# EasyEDA Pro project ProProject_drv8303_f405rgt6_3_5_2025-03-30.epro, schematic Schematic1
Create Date: 2025-03-05; Page Name: P1; Project Name: drv8303_f405rgt6_3_5; Schematic Name: Schematic1; Update Date: 2025-03-10; Company: 嘉立创EDA; Page Size: A4; Version: V1.0
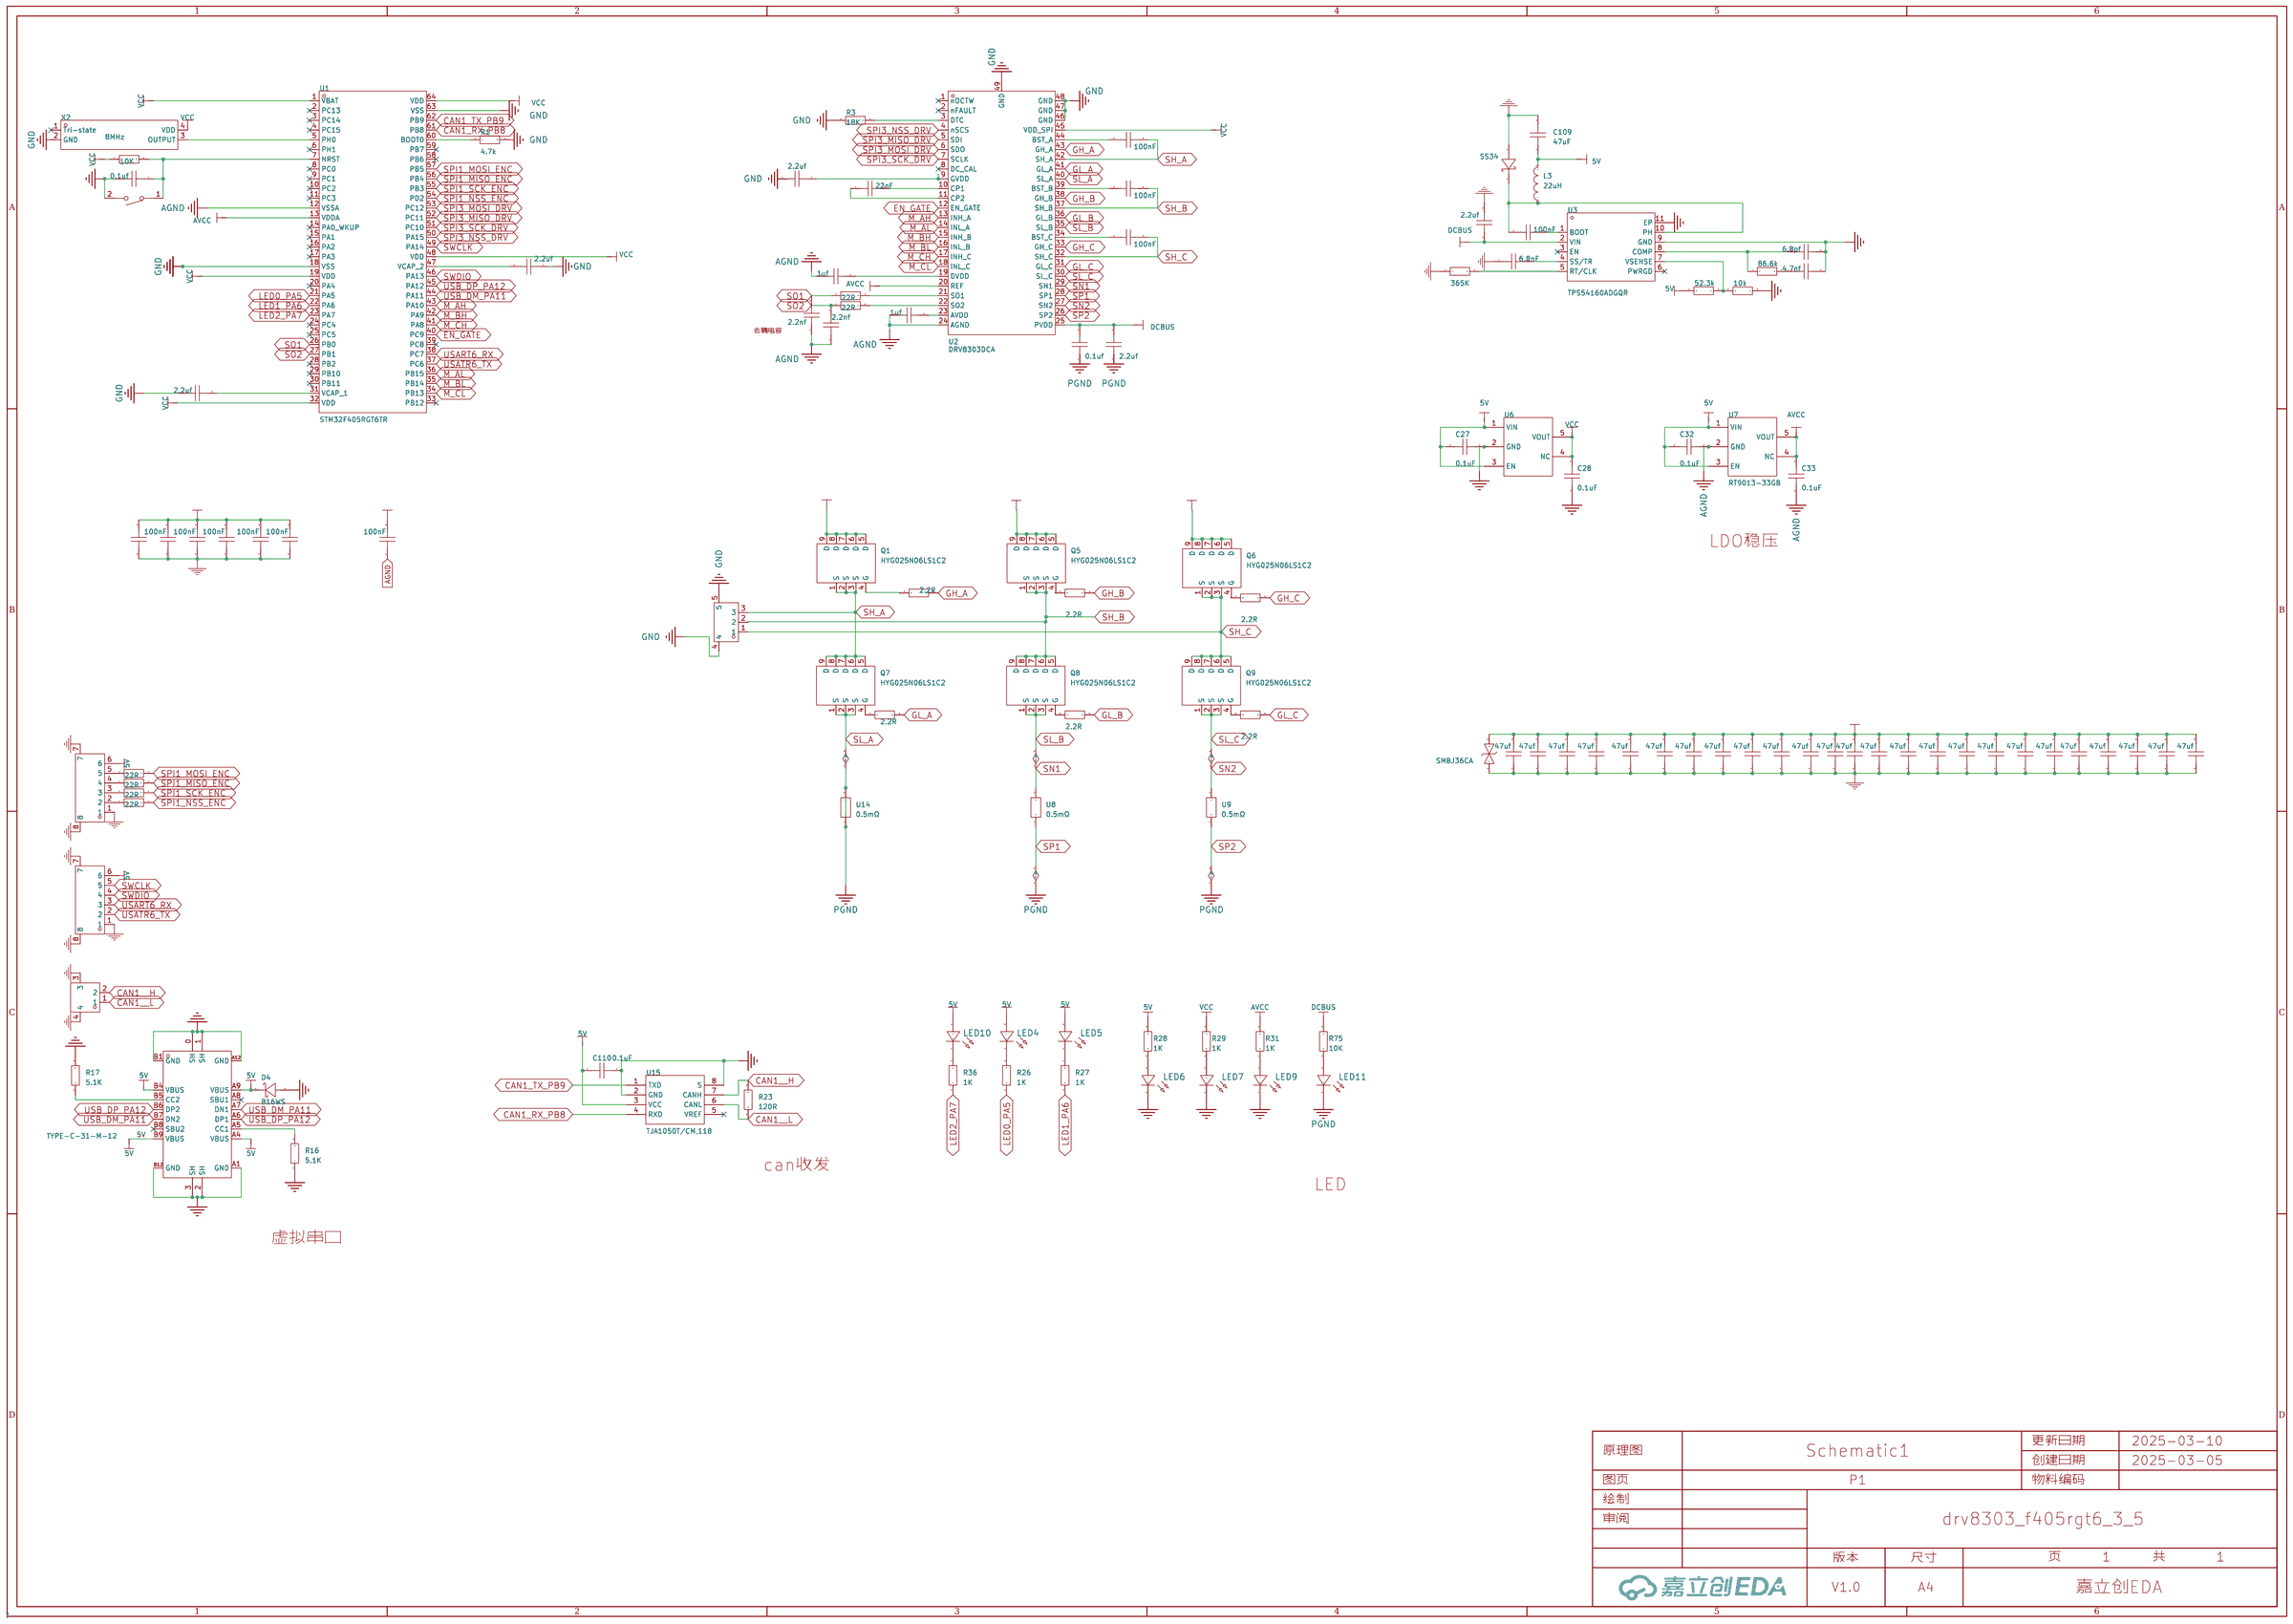
[diagram p0: schematic sheet]

## Parts
C1  2.2uf  [C0603]
C2  2.2uf  [C0603]
C3  0.1uf  [C0603]
C4  22nF  [C0603]
C7  0.1uf  [C0603]
C8  2.2uf  [C0603]
C9  1uf  [C0603]
C10  2.2uf  [C0603]
C11  1uf  [C0603]
C12  100nF  [C0603]
C13  100nF  [C0603]
C14  100nF  [C0603]
C15  2.2nf  [C0603]
C16  2.2nf  [C0603]
C17  100nF  [C0603]
C18  2.2uf  [C0603]
C19  6.8nF  [C0603]
C20  6.8pf  [C0603]
C21  4.7nf  [C0603]
C27  0.1uF  [C0603]
C28  0.1uF  [C0603]
C32  0.1uF  [C0603]
C33  0.1uF  [C0603]
C85  100nF  [C0603]
C86  100nF  [C0603]
C87  100nF  [C0603]
C88  100nF  [C0603]
C89  100nF  [C0603]
C90  100nF  [C0603]
C91  100nF  [C0603]
C97  47uf  [C0603]
C98  47uf  [C0603]
C99  47uf  [C0603]
C100  47uf  [C0603]
C101  47uf  [C0603]
C102  47uf  [C0603]
C103  47uf  [C0603]
C104  47uf  [C0603]
C105  47uf  [C0603]
C106  47uf  [C0603]
C107  47uf  [C0603]
C108  47uf  [C0603]
C109  47uF  [C1206]
C110  0.1uF  [C0603]
C111  47uf  [C0603]
C112  47uf  [C0603]
C113  47uf  [C0603]
C114  47uf  [C0603]
C115  47uf  [C0603]
C116  47uf  [C0603]
C117  47uf  [C0603]
C118  47uf  [C0603]
C120  47uf  [C0603]
C121  47uf  [C0603]
C122  47uf  [C0603]
C123  47uf  [C0603]
C124  47uf  [C0603]
CN2  WAFER-GH1.25-2PLB  [CONN-TH_2P-P1.25_XUNPU_WAFER-GH1.25-2PLB]
D4  B16WS  [SOD-323_L1.7-W1.3-LS2.5-FD]
D5  SS34  [SMA_L4.3-W2.6-LS5.0-FD]
D6  SMBJ36CA  [SMB_L4.6-W3.6-LS5.4-BI]
L3  22uH  [IND-SMD_L2.5-W2.0]
LED4  -  [LED_0603]
LED5  -  [LED_0603]
LED6  -  [LED_0603]
LED7  -  [LED_0603]
LED9  -  [LED_0603]
LED10  -  [LED_0603]
LED11  -  [LED_0603]
Q1  HYG025N06LS1C2  [DFN-8_L5.9-W5.2-P1.27-LS6.2-BL]
Q5  HYG025N06LS1C2  [DFN-8_L5.9-W5.2-P1.27-LS6.2-BL]
Q6  HYG025N06LS1C2  [DFN-8_L5.9-W5.2-P1.27-LS6.2-BL]
Q7  HYG025N06LS1C2  [DFN-8_L5.9-W5.2-P1.27-LS6.2-BL]
Q8  HYG025N06LS1C2  [DFN-8_L5.9-W5.2-P1.27-LS6.2-BL]
Q9  HYG025N06LS1C2  [DFN-8_L5.9-W5.2-P1.27-LS6.2-BL]
R1  4.7k  [R0603]
R2  10K  [R0603]
R3  18K  [R0603]
R4  22R  [R0603]
R5  22R  [R0603]
R16  5.1K  [R0603]
R17  5.1K  [R0603]
R23  120R  [R0603]
R26  1K  [R0603]
R27  1K  [R0603]
R28  1K  [R0603]
R29  1K  [R0603]
R31  1K  [R0603]
R36  1K  [R0603]
R55  86.6k  [R0603]
R56  52.3k  [R0603]
R57  10k  [R0603]
R64  365K  [R0603]
R65  2.2R  [R0603]
R66  2.2R  [R0603]
R67  2.2R  [R0603]
R68  2.2R  [R0603]
R69  2.2R  [R0603]
R70  2.2R  [R0603]
R71  22R  [R0603]
R72  22R  [R0603]
R73  22R  [R0603]
R74  22R  [R0603]
R75  10K  [R0603]
SW9  TS-1088-AR02016  [SW-SMD_L3.9-W3.0-P4.45]
U1  STM32F405RGT6TR  [LQFP-64_L10.0-W10.0-P0.50-LS12.0-BL]
U2  DRV8303DCA  [HTSSOP-48_L12.5-W6.1-P0.50-LS8.1-BL-EP4.4]
U3  TPS54160ADGQR  [MSOP-10_L3.0-W3.0-P0.50-LS5.0-BL-EP]
U6  RT9013-33GB  [SOT-23-5_L3.0-W1.7-P0.95-LS2.8-BL]
U7  RT9013-33GB  [SOT-23-5_L3.0-W1.7-P0.95-LS2.8-BL]
U8  0.5mΩ  [RES-SMD_L6.4-W3.2-R2512]
U9  0.5mΩ  [RES-SMD_L6.4-W3.2-R2512]
U11  WAFER-GH1.25-6PLB  [CONN-SMD_6P-P1.25_XUNPU_WAFER-GH1.25-6PLB]
U12  WAFER-GH1.25-6PLB  [CONN-SMD_6P-P1.25_XUNPU_WAFER-GH1.25-6PLB]
U13  MR30PW-M30.G.Y  [CONN-TH_MR30PW-M30-G-Y]
U14  0.5mΩ  [RES-SMD_L6.4-W3.2-R2512]
U15  TJA1050T/CM,118  [SOIC-8_L5.0-W4.0-P1.27-LS6.0-BL]
USBC1  TYPE-C-31-M-12  [USB-C_SMD-TYPE-C-31-M-12]
X2  8MHz  [OSC-SMD_4P-L3.2-W2.5-BL]

## Library data of the parts
C1-C4 C7-C21 C27 C28 C32 C33 C85-C91 C97-C108 C110-C118 C120-C124 = CAP_0603: Supplier Footprint: 0603
C109 = HGC1206R5476M250NSPJ: 容值:47uF;精度:±20%;额定电压:25V;材质(温度系数):X5R;; LCSC Part Name: 47uF ±20% 25V; Supplier Part: C22367835; Manufacturer: Chinocera(华瓷); Supplier Footprint: 1206; JLCPCB Part Class: 扩展库; Datasheet: https://atta.szlcsc.com/upload/public/pdf/source/20240326/E6CB0DC43BB858B74F4352229FABFDCA.pdf; Supplier: LCSC; Tolerance: ±20%; Voltage Rated: 25V; Temperature Coefficient: X5R
CN2 = WAFER-GH1.25-2PLB: 插针结构:1x2P;间距:1.25mm;安装方式:立贴;参考系列:GH;总PIN数:2P;排数:1;每排PIN数:2;行距:-;额定电流:1A;触头材质:黄铜;触头镀层:-;工作温度范围:-25℃~+85℃;; LCSC Part Name: 1x2P 间距:1.25mm 立贴 系列:GH; Supplier Part: C3029368; Manufacturer: XUNPU(讯普); Supplier Footprint: SMD,P=1.25mm; JLCPCB Part Class: 扩展库; Datasheet: https://atta.szlcsc.com/upload/public/pdf/source/20220527/44F824AAC8C2B617205E15955FF9C23D.pdf; Supplier: LCSC; Pins Structure: 1x2P; Pitch: 1.25mm; Mounting Type: 立贴; Reference Series: GH; Number of Pins: 2P; Number of Rows: 1; Number of PINs Per Row: 2; Current Rating: 1A; Contact Material: 黄铜; Operating Temperature: -25℃~+85℃; Voltage Rating: 125V; Plastic Material: LCP; Supplementary Features: 辅助焊脚; Color: 米色; Z-Height of the Board: 4.2mm; X-Length of Bottom Edge on Board (Spacing Line): 5.75mm; Y-Width of Bottom Edge on Board: 4.95mm
D4 = B16WS_C7420327: 二极管配置:独立式;正向压降(Vf):700mV@1A;直流反向耐压(Vr):60V;平均整流电流(Io):1A;; LCSC Part Name: 电压:60V 电流:1A; Supplier Part: C7420327; Manufacturer: 宏迦橙; Supplier Footprint: SOD-323; JLCPCB Part Class: 扩展库; Datasheet: https://atta.szlcsc.com/upload/public/pdf/source/20230828/F9ABA74578AB4CF1325004D8C613CE3A.pdf; Supplier: LCSC; Diode Configuration: 独立式; Forward Voltage (Vf@If): 700mV@1A; Reverse Voltage (Vr): 60V; Average Rectified Current (Io): 1A; Reverse Leakage Current (Ir): 100uA@60V; Peak forward surge current: 10A
D5 = SS34_C7420365: 二极管配置:独立式;正向压降(Vf):550mV@3.0A;直流反向耐压(Vr):40V;平均整流电流(Io):3A;; LCSC Part Name: 电压:40V 电流:3A; Supplier Part: C7420365; Manufacturer: 宏迦橙; Supplier Footprint: SMA(DO-214AC); JLCPCB Part Class: 扩展库; Datasheet: https://atta.szlcsc.com/upload/public/pdf/source/20230828/75438452AEE6C276EDA92B2AF599BE05.pdf; Supplier: LCSC; Diode Configuration: 独立式; Forward Voltage (Vf@If): 550mV@3.0A; Reverse Voltage (Vr): 40V; Average Rectified Current (Io): 3A; Reverse Leakage Current (Ir): 200uA@40V; Peak forward surge current: 80A
D6 = SMBJ36CA_C2891335: 反向截止电压(Vrwm):36V;钳位电压:58.1V;峰值脉冲电流(Ipp):10.3A;峰值脉冲功率(Ppp):600W;击穿电压:40V;; LCSC Part Name: 双向TVS 36V截止 10.3A峰值脉冲; Supplier Part: C2891335; Manufacturer: GOODWORK(固得沃克); Supplier Footprint: SMB(DO-214AA); JLCPCB Part Class: 扩展库; Datasheet: https://atta.szlcsc.com/upload/public/pdf/source/20240508/1CA20C3E2CA17788E1A78E427E8A26EF.pdf; Supplier: LCSC; Reverse Stand-Off Voltage (Vrwm): 36V; Clamping Voltage: 58.1V; Peak Pulse Current (Ipp): 10.3A; Peak Pulse Power Dissipation (Ppp): 600W; Voltage - Breakdown: 40V; Reverse Leakage Current (Ir): 5uA; Operating Temperature: -55℃~+150℃@(Tj); Type: TVS
L3 = FNR252012S2R2MT: 电感值:2.2uH;精度:±20%;额定电流:1.25A;饱和电流(Isat):2.07A;; LCSC Part Name: 2.2uH ±20% 2.07A; Supplier Part: C167693; Manufacturer: cjiang(长江微电); Supplier Footprint: 1008; JLCPCB Part Class: 扩展库; Datasheet: https://atta.szlcsc.com/upload/public/pdf/source/20190327/C167925_9EFF0AABC4CA629C2CC95961DBF7D39D.pdf; Supplier: LCSC; Tolerance: ±20%; Rated Current: 1.25A; Saturation Current (Isat): 2.07A; DC Resistance (DCR): 216mΩ
LED4-LED7 LED9-LED11 = LED_0603-R: Supplier Footprint: 0603
Q1 Q5-Q9 = HYG025N06LS1C2: 类型:1个N沟道;漏源电压(Vdss):60V;连续漏极电流(Id):170A;导通电阻(RDS(on)):2.1mΩ@10V;耗散功率(Pd):130W;阈值电压(Vgs(th)):2.1V;; LCSC Part Name: 单N沟道MOSFET,电流:170A,耐压:60V; Supplier Part: C2827231; Manufacturer: HUAYI(华羿微); Supplier Footprint: DFN-8(5.2x5.9); JLCPCB Part Class: 扩展库; Datasheet: https://atta.szlcsc.com/upload/public/pdf/source/20210419/C2827231_13841C0339ED96AF58AC5A6C3EF7CB2D.pdf; Supplier: LCSC; Type: 1个N沟道; Drain to Source Voltage: 60V; Current - Continuous Drain(Id): 170A; RDS(on): 2.1mΩ@10V; Pd - Power Dissipation: 130W; Gate Threshold Voltage (Vgs(th)@Id): 2.1V; Gate Charge(Qg): 59.5nC@10V; Input Capacitance(Ciss@Vds): 3.915nF@0V; Reverse Transfer Capacitance (Crss@Vds): 10.2pF; Operating Temperature: -55℃~+175℃
R1-R5 R16 R17 R23 R26-R29 R31 R36 R55-R57 R64-R75 = Res_0603: Supplier Footprint: 0603
SW9 = TS-1088-AR02016: 触点电流:50mA;额定电压(DC):12V;绝缘电阻:100MΩ;电路结构:单刀单掷;安装方式:立贴;作用力:160gf@±50gf;机械寿命:10万次;带支架:否;; LCSC Part Name: 4*3*2mm 立贴 轻触开关; Supplier Part: C720477; Manufacturer: XUNPU(讯普); Supplier Footprint: SMD; JLCPCB Part Class: 扩展库; Datasheet: https://atta.szlcsc.com/upload/public/pdf/source/20200810/C720475_60D09DD6C54279ADDB2DC25100F1CC11.pdf; Supplier: LCSC; Contact Current: 50mA; Voltage Rating (DC): 12V; Insulation Resistance: 100MΩ; Circuit: 单刀单掷; Mounting Style: 立贴; Actuator Style: 圆形按钮; Actuator/Cap Color: 黑色; Operating Force: 160gf@±50gf; Mechanical Life: 10万次; Operating Temperature: -30℃~+80℃; Pin Style: SMD接片; Switch Length: 4mm; Switch Width: 3mm; Switch Height: 2mm; Strike Gundam: 否
U1 = STM32F405RGT6TR: CPU内核:ARM-M4;CPU最大主频:168MHz;应用领域:-;; LCSC Part Name: 带DSP和FPU的高性能基础系列ARM Cortex-M4 MCU，具有1 MB Flash、168 MHz CPU和ART加速器; Supplier Part: C2054141; Manufacturer: ST(意法半导体); Supplier Footprint: LQFP-64(10x10); JLCPCB Part Class: 扩展库; Datasheet: https://atta.szlcsc.com/upload/public/pdf/source/20201130/C919362_39400D478C258148B3DF984CE4A4041A.pdf; Supplier: LCSC; CPU Core: ARM-M4; CPU Maximum Speed: 168MHz; Program Storage Size: 1MB; Program Memory Type: FLASH; Number of I/O: 51; ADC (Bit): 12bit; DAC (Bit): 12bit; Low Voltage Detection Threshold: 1.8V~3.6V
U2 = DRV8303DCA: DRV8303 具有电流分流放大器和 SPI 的最大 65V 三相栅极驱动器; LCSC Part Name: 无刷直流BLDC电机驱动芯片 60V; Supplier Part: C1523892; Manufacturer: TI(德州仪器); Supplier Footprint: HTSSOP-48-EP-6.1mm; JLCPCB Part Class: 扩展库; Datasheet: https://www.ti.com/cn/lit/gpn/drv8303; Supplier: LCSC
U3 = TPS54160ADGQR: 功能类型:降压型;输出类型:固定;工作电压:3.5V~60V;输出电压:800mV~58V;输出电流:1.5A;; LCSC Part Name: 60V 1.5A降压DC/DC转换器; Supplier Part: C390949; Manufacturer: TI(德州仪器); Supplier Footprint: MSOP-10-EP; JLCPCB Part Class: 扩展库; Datasheet: https://www.ti.com/cn/lit/gpn/tps54160a; Supplier: LCSC; Function: 降压型; Output Type: 固定; Input Voltage: 3.5V~60V; Output Voltage: 800mV~58V; Output Current: 1.5A; Switching Frequency: 100kHz~2.5MHz; Operating Temperature: -40℃~+150℃; Synchronous Rectification: 是; Number of Outputs: 1; Topology: 降压式; Quiescent Current (Iq): 116uA; Switch tube (built-in/external): 内置
U6 U7 = RT9013-33GB: 输出类型:固定;输出极性:正;最大输入电压:5.5V;输出电压:3.3V;输出电流:500mA;电源纹波抑制比(PSRR):50dB@(10kHz);; Supplier Part: C47773; Manufacturer: RICHTEK(立锜); Supplier Footprint: SOT-23-5; JLCPCB Part Class: Extended Part; Datasheet: https://atta.szlcsc.com/upload/public/pdf/source/20150504/1457707282459.pdf; Supplier: LCSC; Output Type: 固定; Output Polarity: 正; Number of Outputs: 1; Maximum Input Voltage: 5.5V; Output Voltage: 3.3V; Dropout Voltage: 400mV@(500mA); Output Current: 500mA; Power Supply Rejection Ratio (PSRR): 50dB@(10kHz)
U8 U9 U14 = LRAN25GJER0005S: 电阻类型:采样电阻;阻值:0.5mΩ;精度:±5%;功率:3W;; LCSC Part Name: 0.5mΩ ±5% 3W; Supplier Part: C5121029; Manufacturer: NCT(利昇达); Supplier Footprint: 2512; JLCPCB Part Class: 扩展库; Datasheet: https://atta.szlcsc.com/upload/public/pdf/source/20220802/2693C2EE618FE3489E564C832611E315.pdf; Supplier: LCSC; Type: 采样电阻; Tolerance: ±5%; Power(Watts): 3W
U11 U12 = WAFER-GH1.25-6PLB: 插针结构:1x6P;间距:1.25mm;安装方式:立贴;参考系列:GH;总PIN数:6P;排数:1;每排PIN数:6;行距:-;额定电流:1A;触头材质:黄铜;触头镀层:-;工作温度范围:-25℃~+85℃;; LCSC Part Name: 1x6P 间距:1.25mm 立贴 系列:GH; Supplier Part: C3029372; Manufacturer: XUNPU(讯普); Supplier Footprint: SMD,P=1.25mm; JLCPCB Part Class: 扩展库; Datasheet: https://atta.szlcsc.com/upload/public/pdf/source/20220527/44F824AAC8C2B617205E15955FF9C23D.pdf; Supplier: LCSC; Pins Structure: 1x6P; Pitch: 1.25mm; Mounting Type: 立贴; Reference Series: GH; Number of Pins: 6P; Number of Rows: 1; Number of PINs Per Row: 6; Current Rating: 1A; Contact Material: 黄铜; Operating Temperature: -25℃~+85℃; Voltage Rating: 125V; Plastic Material: LCP; Supplementary Features: 辅助焊脚; Color: 米色; Z-Height of the Board: 4.2mm; X-Length of Bottom Edge on Board (Spacing Line): 10.75mm; Y-Width of Bottom Edge on Board: 4.95mm
U13 = MR30PW-M30.G.Y: LCSC Part Name: MR30PW20三芯PCB 弯插公金黄H=3mm; Supplier Part: C19268036; Manufacturer: AMASS(艾迈斯); JLCPCB Part Class: 扩展库; Datasheet: https://atta.szlcsc.com/upload/public/pdf/source/20231221/E63D24EDC016665263C6304FABBAAC61.pdf; Supplier: LCSC
U15 = TJA1050T/CM,118: 类型:收发器;; LCSC Part Name: 4.75V~5.25V; Supplier Part: C6952; Manufacturer: NXP(恩智浦); Supplier Footprint: SOIC-8; JLCPCB Part Class: Basic Part; Datasheet: https://atta.szlcsc.com/upload/public/pdf/source/20140411/1457707042917.pdf; Supplier: LCSC; Type: 收发器; Supply Voltage: 4.75V~5.25V; Supply Current: 50mA
USBC1 = TYPE-C-31-M-12: 连接器类型:Type-C;标准:-;公母:母座;触点数量:16;端口数量:1;安装方式:-;额定电流 - 电源:5A;触头材质:-;触头镀层:-;工作温度范围:-;焊接温度(最大值):-;; LCSC Part Name: Type-C 母座; Supplier Part: C165948; Manufacturer: 韩国韩荣; Supplier Footprint: SMD; JLCPCB Part Class: Extended Part; Datasheet: https://atta.szlcsc.com/upload/public/pdf/source/20220525/466408E853115E789EDB0DDC29077C05.pdf; Supplier: LCSC; Connector Type: Type-C; Gender: 母座; Number of Contacts: 16; Number of Ports: 1; Current Rating - Power (Max): 5A
X2 = OT32258MJBA4SL: 频率:8MHz;频率稳定度:±10ppm;工作电压:1.8V~3.3V;; LCSC Part Name: 8MHz ±10ppm 1.8V~3.3V; Supplier Part: C717687; Manufacturer: YXC(扬兴晶振); Supplier Footprint: SMD3225-4P; JLCPCB Part Class: Extended Part; Datasheet: https://atta.szlcsc.com/upload/public/pdf/source/20210329/C669065_30B18CFE780D377BA4E84F6ED1951959.pdf; Supplier: LCSC; Frequency Stability: ±10ppm; Supply Voltage: 1.8V~3.3V; Operating Temperature: -40℃~+85℃

## Nets
5V: C27.2 C32.2 C109.1 C110.1 D4.2(K) L3.2 LED4.2(A) LED5.2(A) LED10.2(A) R28.2 R56.1 U6.1(VIN) U6.3(EN) U7.1(VIN) U7.3(EN) U11.6 U12.6 U15.3(VCC) USBC1.A4(VBUS) USBC1.A9(VBUS) USBC1.B4(VBUS) USBC1.B9(VBUS)
AGND: C9.2 C11.2 C15.1 C16.1 C32.1 C33.1 C91.1 U1.12(VSSA) U2.24(AGND) U7.2(GND)
AVCC: C33.2 C91.2 R31.2 U1.13(VDDA) U2.20(REF) U7.4(NC) U7.5(VOUT)
GND: C1.1 C2.1 C3.1 C10.2 C20.2 C21.2 C27.1 C28.1 C85.1 C86.1 C87.1 C88.1 C89.1 C90.1 C109.2 C110.2 CN2.3 CN2.4 D4.1(A) D5.1(A) LED6.1(C) LED7.1(C) LED9.1(C) R1.2 R3.1 R16.1 R17.2 R57.2 R64.1 SW9.2 U1.18(VSS) U1.63(VSS) U2.46(GND) U2.47(GND) U2.48(GND) U2.49(GND) U3.9(GND) U3.11(EP) U6.2(GND) U11.1 U11.7 U11.8 U12.1 U12.7 U12.8 U13.4 U13.5 U15.2(GND) U15.8(S) USBC1.0(SH) USBC1.1(SH) USBC1.2(SH) USBC1.3(SH) USBC1.A1(GND) USBC1.A12(GND) USBC1.B1(GND) USBC1.B12(GND) X2.2(GND)
PGND: C7.1 C8.1 C18.2 C19.1 C97.1 C98.1 C99.1 C100.1 C101.1 C102.1 C103.1 C104.1 C105.1 C106.1 C107.1 C108.1 C111.1 C112.1 C113.1 C114.1 C115.1 C116.1 C117.1 C118.1 C120.1 C121.1 C122.1 C123.1 C124.1 D6.1 LED11.1(C) Q7.1(S) Q7.2(S) Q7.3(S) U2.26(SP2) U2.28(SP1) U2.40(SL_A) U8.1 U9.1 U14.1 U14.2
VCC: C28.2 C85.2 C86.2 C87.2 C88.2 C89.2 C90.2 R2.1 R29.2 U1.1(VBAT) U1.19(VDD) U1.32(VDD) U1.48(VDD) U1.64(VDD) U2.45(VDD_SPI) U6.4(NC) U6.5(VOUT) X2.4(VDD)
CAN1__H: CN2.2 R23.2 U15.7(CANH)
CAN1__L: CN2.1 R23.1 U15.6(CANL)
CAN1_RX_PB8: U1.61(PB8) U15.4(RXD)
CAN1_TX_PB9: U1.62(PB9) U15.1(TXD)
DCBUS: C7.2 C8.2 C18.1 C97.2 C98.2 C99.2 C100.2 C101.2 C102.2 C103.2 C104.2 C105.2 C106.2 C107.2 C108.2 C111.2 C112.2 C113.2 C114.2 C115.2 C116.2 C117.2 C118.2 C120.2 C121.2 C122.2 C123.2 C124.2 D6.2 Q1.5(D) Q1.6(D) Q1.7(D) Q1.8(D) Q1.9(D) Q5.5(D) Q5.6(D) Q5.7(D) Q5.8(D) Q5.9(D) Q6.5(D) Q6.6(D) Q6.7(D) Q6.8(D) Q6.9(D) R75.2 U2.25(PVDD) U3.2(VIN)
EN_GATE: U1.40(PC9) U2.12(EN_GATE)
GH_A: R65.2 U2.43(GH_A)
GH_B: R66.2 U2.38(GH_B)
GH_C: R67.2 U2.33(GH_C)
GL_A: R70.2 U2.41(GL_A)
GL_B: R69.2 U2.36(GL_B)
GL_C: R68.2 U2.31(GL_C)
LED0_PA5: R26.1 U1.21(PA5)
LED1_PA6: R27.1 U1.22(PA6)
LED2_PA7: R36.1 U1.23(PA7)
M_AH: U1.43(PA10) U2.13(INH_A)
M_AL: U1.36(PB15) U2.14(INL_A)
M_BH: U1.42(PA9) U2.15(INH_B)
M_BL: U1.35(PB14) U2.16(INL_B)
M_CH: U1.41(PA8) U2.17(INH_C)
M_CL: U1.34(PB13) U2.18(INL_C)
SH_A: C12.2 Q1.1(S) Q1.2(S) Q1.3(S) Q7.5(D) Q7.6(D) Q7.7(D) Q7.8(D) Q7.9(D) U2.42(SH_A) U13.3
SH_B: C13.2 Q5.1(S) Q5.2(S) Q5.3(S) Q8.5(D) Q8.6(D) Q8.7(D) Q8.8(D) Q8.9(D) U2.37(SH_B) U13.2
SH_C: C14.2 Q6.1(S) Q6.2(S) Q6.3(S) Q9.5(D) Q9.6(D) Q9.7(D) Q9.8(D) Q9.9(D) U2.32(SH_C) U13.1
SL_B: Q8.1(S) Q8.2(S) Q8.3(S) U2.29(SN1) U2.35(SL_B) U8.2
SL_C: Q9.1(S) Q9.2(S) Q9.3(S) U2.27(SN2) U2.30(SL_C) U9.2
SO1: C15.2 R4.1 U1.26(PB0)
SO2: C16.2 R5.1 U1.27(PB1)
SPI1_MISO_ENC: R72.2 U1.56(PB4)
SPI1_MOSI_ENC: R71.2 U1.57(PB5)
SPI1_NSS_ENC: R74.2 U1.54(PD2)
SPI1_SCK_ENC: R73.2 U1.55(PB3)
SPI3_MISO_DRV: U1.52(PC11) U2.5(SDI)
SPI3_MOSI_DRV: U1.53(PC12) U2.6(SDO)
SPI3_NSS_DRV: U1.50(PA15) U2.4(nSCS)
SPI3_SCK_DRV: U1.51(PC10) U2.7(SCLK)
SWCLK: U1.49(PA14) U12.5
SWDIO: U1.46(PA13) U12.4
USART6_RX: U1.38(PC7) U12.3
USATR6_TX: U1.37(PC6) U12.2
USB_DM_PA11: U1.44(PA11) USBC1.A7(DN1) USBC1.B7(DN2)
USB_DP_PA12: U1.45(PA12) USBC1.A6(DP1) USBC1.B6(DP2)
$1N588: U1.5(PH0) X2.3(OUTPUT)
$1N664: R1.1 U1.60(BOOT0)
$1N1058: C1.2 U1.31(VCAP_1)
$1N1138: C2.2 U1.47(VCAP_2)
$1N1421: C3.2 R2.2 SW9.1 U1.7(NRST)
$1N1824: R3.2 U2.3(DTC)
$1N1939: C10.1 U2.9(GVDD)
$1N2052: C4.2 U2.10(CP1)
$1N2055: C4.1 U2.11(CP2)
$1N2659: C9.1 U2.23(AVDD)
$1N2783: C11.1 U2.19(DVDD)
$1N2865: R4.2 U2.21(SO1)
$1N2894: R5.2 U2.22(SO2)
$1N3761: C12.1 U2.44(BST_A)
$1N3769: C13.1 U2.39(BST_B)
$1N3777: C14.1 U2.34(BST_C)
$1N4921: C17.1 D5.2(K) L3.1 U3.10(PH)
$1N4933: C17.2 U3.1(BOOT)
$1N5046: C19.2 U3.4(SS/TR)
$1N5104: R64.2 U3.5(RT/CLK)
$1N5267: C21.1 R55.2
$1N5275: C20.1 R55.1 U3.8(COMP)
$1N5335: R56.2 R57.1 U3.7(VSENSE)
$1N14306: Q9.4(G) R68.1
$1N14335: Q8.4(G) R69.1
$1N14364: Q7.4(G) R70.1
$1N18515: R17.1 USBC1.B5(CC2)
$1N18516: R16.2 USBC1.A5(CC1)
$1N20180: LED4.1(C) R26.2
$1N20181: LED5.1(C) R27.2
$1N20185: LED6.2(A) R28.1
$1N20188: LED7.2(A) R29.1
$1N20191: LED9.2(A) R31.1
$1N20194: LED10.1(C) R36.2
$1N21133: LED11.2(A) R75.1
$1N23634: Q1.4(G) R65.1
$1N23641: Q5.4(G) R66.1
$1N23648: Q6.4(G) R67.1
Net-(R71-1): R71.1 U11.5
Net-(R72-1): R72.1 U11.4
Net-(R73-1): R73.1 U11.3
Net-(R74-1): R74.1 U11.2

Not connected (* = marked no-connect by the designer): U1 2(PC13)* 3(PC14)* 4(PC15)* 6(PH1)* 8(PC0)* 9(PC1)* 10(PC2)* 11(PC3)* 14(PA0_WKUP)* 15(PA1)* 16(PA2)* 17(PA3)* 20(PA4)* 24(PC4)* 25(PC5)* 28(PB2)* 29(PB10)* 30(PB11)* 33(PB12)* 39(PC8)* 58(PB6)* 59(PB7)*; U2 1(nOCTW)* 2(nFAULT)* 8(DC_CAL)*; U3 3(EN)* 6(PWRGD)*; U15 5(VREF)*; USBC1 A8(SBU1)* B8(SBU2)*; X2 1(Tri-state)*

## Notes on the sheet
- 去耦电容
- LDO稳压
- can收发
- LED
- 虚拟串口
